# EAGLE design power-rail (EAGLE 9.7.0)
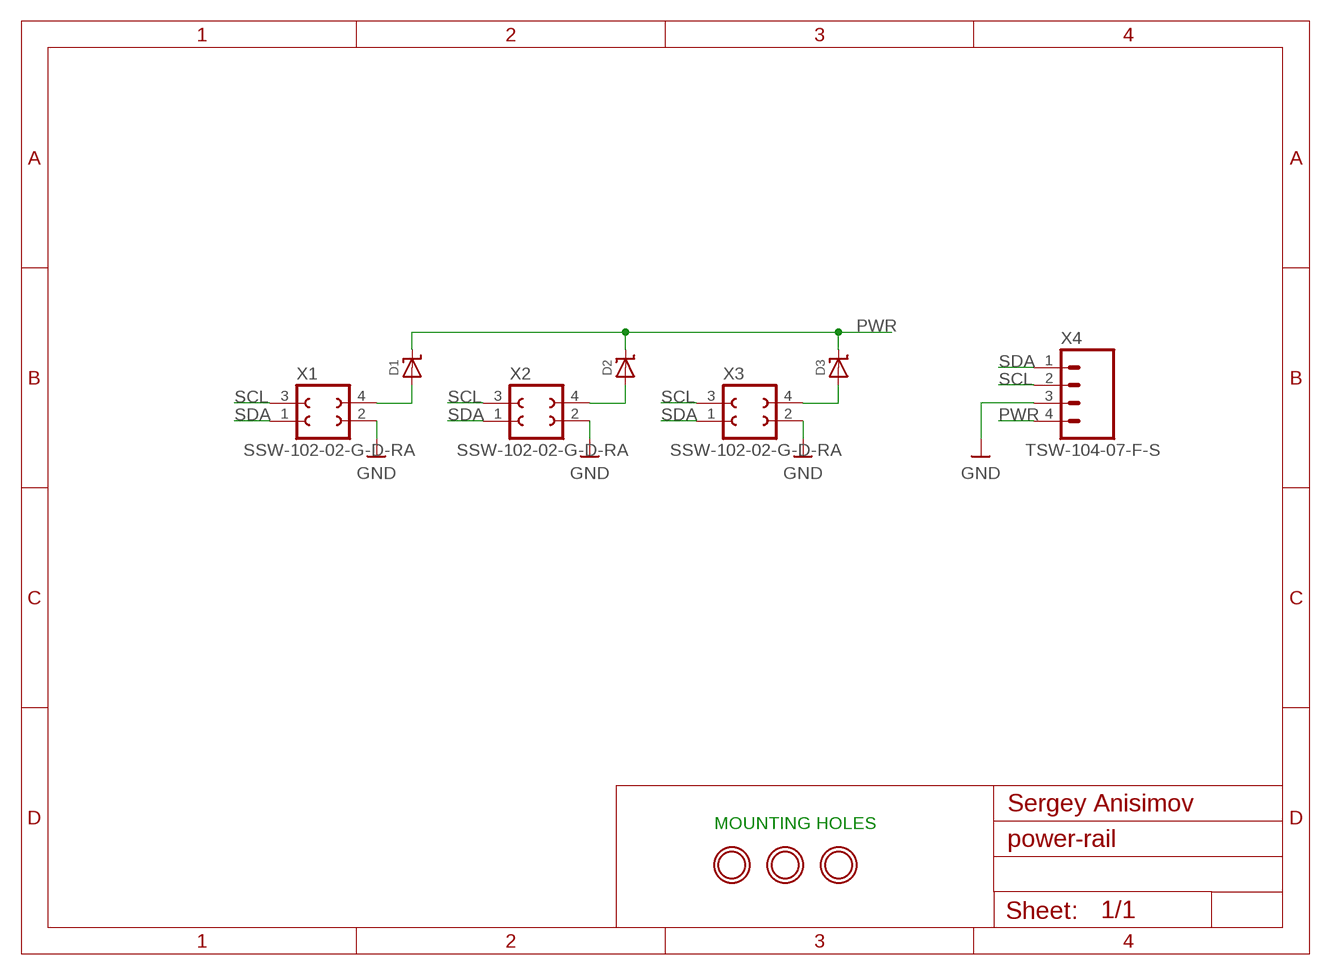
[diagram p0: schematic, sheet 1]

## Parts
D1  DIODE-SCHOTTKYSOD−123FL  [SODFL3616X98]
D2  DIODE-SCHOTTKYSOD−123FL  [SODFL3616X98]
D3  DIODE-SCHOTTKYSOD−123FL  [SODFL3616X98]
U$5  MOUNTING-HOLE2.7_THICK  [MOUNTINGHOLE_2.7_PLATED_THICK]
U$6  MOUNTING-HOLE2.7_THICK  [MOUNTINGHOLE_2.7_PLATED_THICK]
U$7  MOUNTING-HOLE2.7_THICK  [MOUNTINGHOLE_2.7_PLATED_THICK]
X1  SSW-102-02-G-D-RA  CON-FE-02-02SSQ-102-02-T-D-RA  [SSQ-102-02-T-D-RA]
X2  SSW-102-02-G-D-RA  CON-FE-02-02SSQ-102-02-T-D-RA  [SSQ-102-02-T-D-RA]
X3  SSW-102-02-G-D-RA  CON-FE-02-02SSQ-102-02-T-D-RA  [SSQ-102-02-T-D-RA]
X4  TSW-104-07-F-S  CON-MA-04-01TSW-104-07-G-S  [HDRV4W64P254_1X4_1016X254X838B]

## Nets
GND: X1.2 X2.2 X3.2 X4.3
N$1: D1.A X1.4
N$2: D2.A X2.4
N$3: D3.A X3.4
PWR: D1.C D2.C D3.C X4.4
SCL: X1.3 X2.3 X3.3 X4.2
SDA: X1.1 X2.1 X3.1 X4.1

## Notes on the sheet
- Sergey Anisimov
- MOUNTING HOLES

## Library data of the parts
D1-D3 = Library:DIODE-SCHOTTKY
U$5-U$7 = Library:MOUNTING-HOLE: Mounting Hole For #2 screws (0.086"/2.18mm width, 0.094"/2.4mm hole) use 2.5mm; BOM: EXCLUDE
X1-X3 = Library:CON-FE-02-02
X4 = Library:CON-MA-04-01

## Board
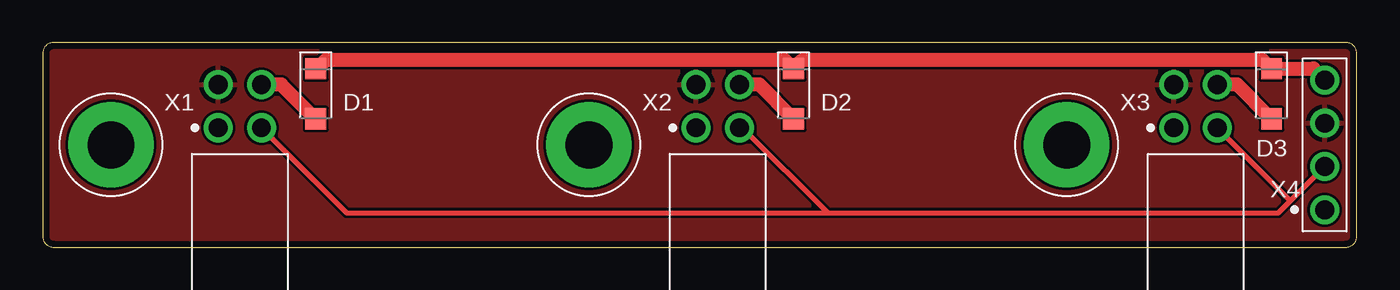
[diagram p1: board, top side]
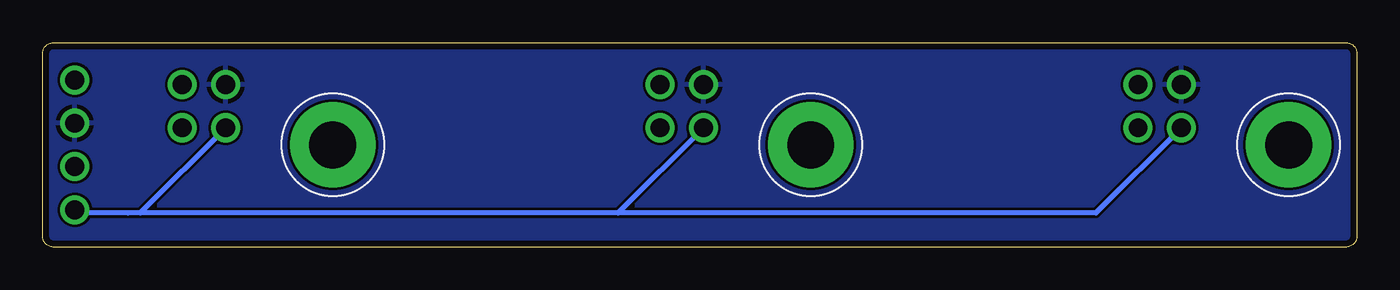
[diagram p2: board, bottom side, seen from below]

Size 77 x 12 mm. Coordinates in mm from the lower left corner, seen from the top.
Outline: 0,11.37 0,0.64 arc90 0.64,0 76.36,0 arc90 77,0.64 77,11.37 arc90 76.36,12 0.64,12 arc90 0,11.37
Copper layers (1*16): Top 0.0361mm / dielectric 1.572mm / Bottom 0.0361mm
Design rules "oshpark-2layer *": minimum track width 6mil, minimum drill 10mil, track to track 6mil, track to pad 6mil, pad to pad 6mil, via to via 6mil, smd to smd 6mil, copper to edge 15mil, drill to drill 6mil, minimum pad ring 5mil, minimum via ring 5mil, stop-mask expansion 2.5mil, vias tented up to drill 0mil, thermal gap 10mil

### Footprints (pad centres in the part's own frame; a part is rotated, then mirrored left to right if it is on the bottom)
SODFL3616X98 = smd 1.25 x 1.22: A 1.475,0; C -1.475,0
MOUNTINGHOLE_2.7_PLATED_THICK = drill 2.75 pad 5: P$1 0,0
SSQ-102-02-T-D-RA = drill 1.105 pad 1.705: 1 0,0; 2 0,2.54; 3 2.54,0; 4 2.54,2.54
HDRV4W64P254_1X4_1016X254X838B = drill 1.105 pad 1.705: 1 0,0; 2 2.54,0; 3 5.08,0; 4 7.62,0

### Placement (x,y rotation side)
D1  16,9 270 top
D2  44,9 270 top
D3  72,9 270 top
U$5  60,6 0 top
U$6  4,6 0 top
U$7  32,6 0 top
X1  10.28,7 0 top
X2  38.28,7 0 top
X3  66.28,7 0 top
X4  75.11,2.19 90 top

### Tracks (layer width: path | path; a pad name or v marks a point on that pad's centre or on a via)
GND
  pour Top: -0.85,-2.85 77.85,-2.85 77.85,13.85 -0.85,13.85
  pour Bottom: -0.85,-2.85 77.85,-2.85 77.85,13.85 -0.85,13.85
N$1
  Top 0.813: D1.A 13.98,9.54 X1.4
N$2
  Top 0.813: D2.A 41.98,9.54 X2.4
N$3
  Top 0.813: D3.A 69.98,9.54 X3.4
PWR
  Top 0.813: X4.4 74.45,10.47 D3.C 71.47,11 44.52,11 D2.C 43.48,11 16.6,11 16.07,10.47 D1.C
SCL
  Top 0.305: X1.3 17.82,2 46,2 | X2.3 41,7 46,2 | 46,2 72.39,2 73.19,2.81 | 73.19,2.81 X4.2 | X3.3 73.01,2.81 73.19,2.81
SDA
  Bottom 0.305: X1.1 15.28,2 43.28,2 | 43.28,2 71.28,2 | X4.1 74.92,2 72,2 71.28,2 | X2.1 43.28,2 | X3.1 71.28,2